# EAGLE design LPC1343 Module (EAGLE 6.3)
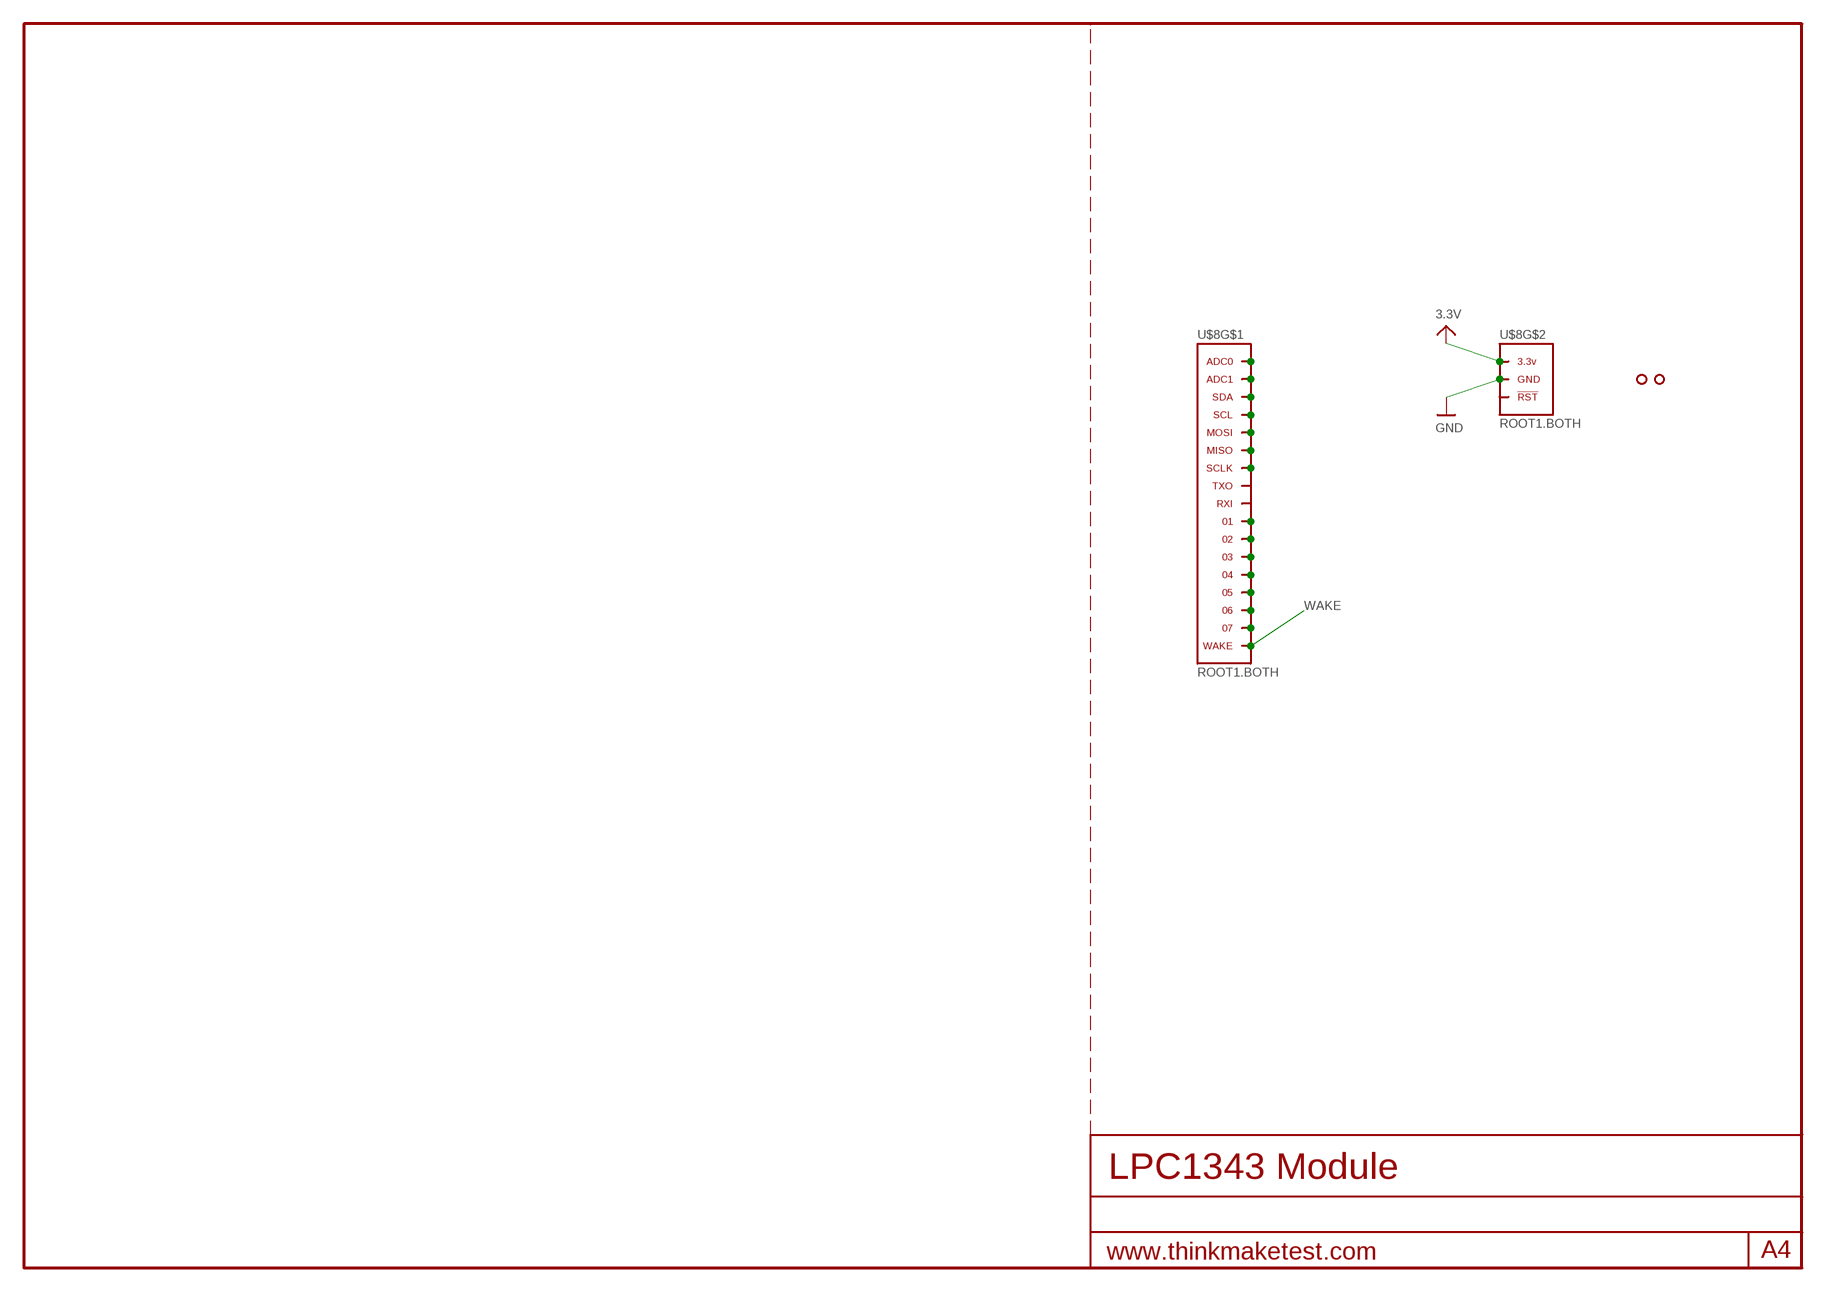
[diagram p0: schematic, sheet 1, part 1 of 2]
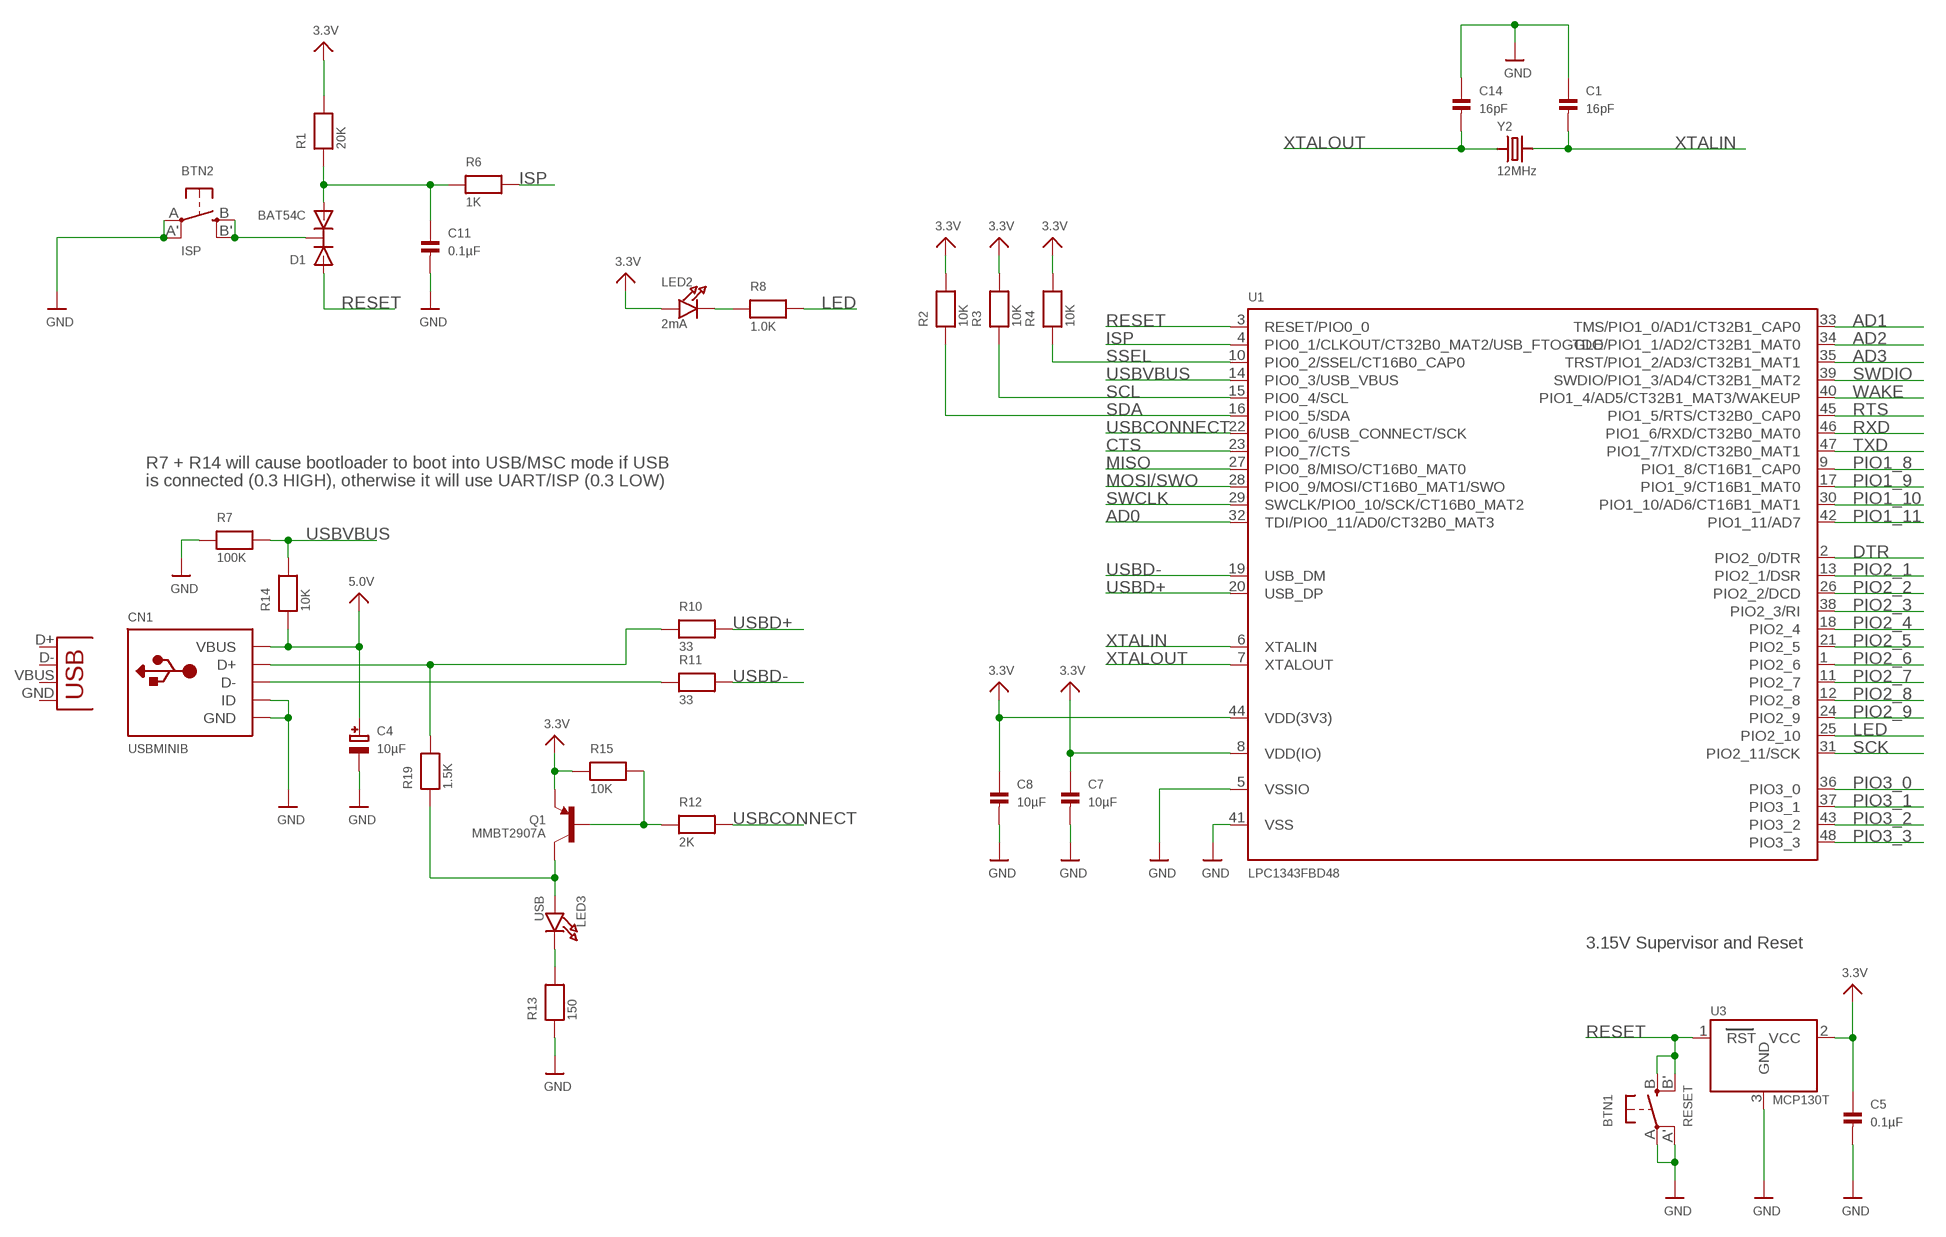
[diagram p1: schematic, sheet 1, part 2 of 2]

## Parts
BTN1  RESET  BUTTON_SMT  [EVQ-Q2]
BTN2  ISP  BUTTON_SMT  [EVQ-Q2]
C1  16pF  CAP_CERAMIC0603  [0603]
C4  10µF  CAP_TANTALUMA/3216_REFLOW  [EIA3216-18/A-R]
C5  0.1µF  CAP_CERAMIC0603  [0603]
C7  10µF  CAP_CERAMIC0805  [0805]
C8  10µF  CAP_CERAMIC0805  [0805]
C11  0.1µF  CAP_CERAMIC0603  [0603]
C14  16pF  CAP_CERAMIC0603  [0603]
CN1  USBMINIB  [USB-MINIB]
D1  BAT54C  [SOT23-R]
LED2  2mA  LED0805  [CHIPLED_0805]
LED3  USB  LED0805  [CHIPLED_0805]
Q1  MMBT2907A  TRANSISTOR_PNPSOT23-REFLOW  [SOT23-R]
R1  20K  RESISTOR0603  [0603]
R2  10K  RESISTOR0603  [0603]
R3  10K  RESISTOR0603  [0603]
R4  10K  RESISTOR0603  [0603]
R6  1K  RESISTOR0603  [0603]
R7  100K  RESISTOR0603  [0603]
R8  1.0K  RESISTOR0603  [0603]
R10  33  RESISTOR0603  [0603]
R11  33  RESISTOR0603  [0603]
R12  2K  RESISTOR0603  [0603]
R13  150  RESISTOR0603  [0603]
R14  10K  RESISTOR0603  [0603]
R15  10K  RESISTOR0603  [0603]
R19  1.5K  RESISTOR0603  [0603]
U1  LPC1343FBD48  LPC1343_QFP  [LQFP48]
U3  MCP130T  MCP130TREFLOW  [SOT23-R]
U$3  HOLE.2MM  [2MM]
U$4  HOLE.2MM  [2MM]
U$8  ROOT1.BOTH  [ROOT1.BOTH]
X1  USB-MICROB  [USB-MICROB]
Y2  12MHz  CRYSTALTHIN  [CRYSTAL_3.2X2.5]

## Nets
3.3V: C5.1 C7.1 C8.1 LED2.A Q1.2(E) R1.2 R2.2 R3.2 R4.2 R15.1 U1.8(VDD(IO)) U1.44(VDD(3V3)) U3.2(VCC) U$8.3.3V@1(3.3V) U$8.3.3V@2(3.3V) U$8.3.3V@3(3.3V) U$8.3.3V@4(3.3V) U$8.3.3V@5(3.3V) U$8.3.3V@6(3.3V) U$8.3.3V@7(3.3V) U$8.3.3V@8(3.3V) U$8.3.3V@9(3.3V) U$8.3.3V@10(3.3V) U$8.3.3V@11(3.3V) U$8.3.3V@12(3.3V) U$8.3.3V@13(3.3V) U$8.3.3V@14(3.3V) U$8.3.3V@15(3.3V) U$8.3.3V@16(3.3V) U$8.3.3V@17(3.3V) U$8.3.3V@18(3.3V) U$8.3.3V@19(3.3V) U$8.3.3V@20(3.3V) U$8.3.3V@21(3.3V) U$8.3.3V@22(3.3V) U$8.3.3V@23(3.3V) U$8.3.3V@24(3.3V) U$8.3.3V@VIA(3.3V)
5.0V: C4.+ CN1.VBUS R14.1
AD0: U1.32(TDI/PIO0_11/AD0/CT32B0_MAT3)
AD1: U1.33(TMS/PIO1_0/AD1/CT32B1_CAP0)
AD2: U1.34(TDO/PIO1_1/AD2/CT32B1_MAT0)
AD3: U1.35(TRST/PIO1_2/AD3/CT32B1_MAT1)
CTS: U1.23(PIO0_7/CTS)
DTR: U1.2(PIO2_0/DTR)
GND: BTN1.A'(P1) BTN1.A(P) BTN2.A'(P1) BTN2.A(P) C1.1 C4.- C5.2 C7.2 C8.2 C11.2 C14.1 CN1.GND CN1.ID R7.1 R13.1 U1.5(VSSIO) U1.41(VSS) U3.3(GND) U$8.GND@1(GND) U$8.GND@2(GND) U$8.GND@3(GND) U$8.GND@4(GND) U$8.GND@5(GND) U$8.GND@6(GND) U$8.GND@7(GND) U$8.GND@8(GND) U$8.GND@9(GND) U$8.GND@10(GND) U$8.GND@11(GND) U$8.GND@12(GND) U$8.GND@13(GND) U$8.GND@14(GND) U$8.GND@15(GND) U$8.GND@16(GND) U$8.GND@17(GND) U$8.GND@18(GND) U$8.GND@19(GND) U$8.GND@20(GND) U$8.GND@21(GND) U$8.GND@22(GND) U$8.GND@23(GND) U$8.GND@24(GND) U$8.GND@25(GND) U$8.GND@26(GND) U$8.GND@VIA(GND)
ISP: R6.2 U1.4(PIO0_1/CLKOUT/CT32B0_MAT2/USB_FTOGGLE)
LED: R8.2 U1.25(PIO2_10)
MISO: U1.27(PIO0_8/MISO/CT16B0_MAT0)
MOSI/SWO: U1.28(PIO0_9/MOSI/CT16B0_MAT1/SWO)
N$1: U$8.ADC0 U$8.ADC0@1(ADC0) U$8.ADC0@VIA(ADC0)
N$2: U$8.ADC1 U$8.ADC1@1(ADC1) U$8.ADC1@VIA(ADC1)
N$3: U$8.SDA U$8.SDA@1(SDA) U$8.SDA@VIA(SDA)
N$4: U$8.SCL U$8.SCL@1(SCL) U$8.SCL@VIA(SCL)
N$5: U$8.MOSI U$8.MOSI@1(MOSI) U$8.MOSI@VIA(MOSI)
N$6: U$8.MISO U$8.MISO@1(MISO) U$8.MISO@VIA(MISO)
N$7: U$8.SCLK U$8.SCLK@1(SCLK) U$8.SCLK@VIA(SCLK)
N$8: U$8.01 U$8.01@1 U$8.01@VIA
N$9: U$8.02 U$8.02@1 U$8.02@VIA
N$10: U$8.03 U$8.03@1 U$8.03@VIA
N$11: U$8.04 U$8.04@1 U$8.04@VIA
N$12: U$8.05 U$8.05@1 U$8.05@VIA
N$13: U$8.06 U$8.06@1 U$8.06@VIA
N$14: U$8.07 U$8.07@1 U$8.07@VIA
N$16: LED2.C R8.1
N$17: Q1.1(B) R12.1 R15.2
N$18: LED3.C R13.2
N$19: LED3.A Q1.3(C) R19.1
N$20: CN1.D- R11.1
N$21: CN1.D+ R10.1 R19.2
N$22: BTN2.B'(S1) BTN2.B(S) D1.3(C)
N$23: C11.1 D1.2(A2) R1.1 R6.1
PIO1_8: U1.9(PIO1_8/CT16B1_CAP0)
PIO1_9: U1.17(PIO1_9/CT16B1_MAT0)
PIO1_10: U1.30(PIO1_10/AD6/CT16B1_MAT1)
PIO1_11: U1.42(PIO1_11/AD7)
PIO2_1: U1.13(PIO2_1/DSR)
PIO2_2: U1.26(PIO2_2/DCD)
PIO2_3: U1.38(PIO2_3/RI)
PIO2_4: U1.18(PIO2_4)
PIO2_5: U1.21(PIO2_5)
PIO2_6: U1.1(PIO2_6)
PIO2_7: U1.11(PIO2_7)
PIO2_8: U1.12(PIO2_8)
PIO2_9: U1.24(PIO2_9)
PIO3_0: U1.36(PIO3_0)
PIO3_1: U1.37(PIO3_1)
PIO3_2: U1.43(PIO3_2)
PIO3_3: U1.48(PIO3_3)
RESET: BTN1.B'(S1) BTN1.B(S) D1.1(A1) U1.3(RESET/PIO0_0) U3.1(RST)
RTS: U1.45(PIO1_5/RTS/CT32B0_CAP0)
RXD: U1.46(PIO1_6/RXD/CT32B0_MAT0)
SCK: U1.31(PIO2_11/SCK)
SCL: R3.1 U1.15(PIO0_4/SCL)
SDA: R2.1 U1.16(PIO0_5/SDA)
SSEL: R4.1 U1.10(PIO0_2/SSEL/CT16B0_CAP0)
SWCLK: U1.29(SWCLK/PIO0_10/SCK/CT16B0_MAT2)
SWDIO: U1.39(SWDIO/PIO1_3/AD4/CT32B1_MAT2)
TXD: U1.47(PIO1_7/TXD/CT32B0_MAT1)
USBCONNECT: R12.2 U1.22(PIO0_6/USB_CONNECT/SCK)
USBD+: R10.2 U1.20(USB_DP)
USBD-: R11.2 U1.19(USB_DM)
USBVBUS: R7.2 R14.2 U1.14(PIO0_3/USB_VBUS)
WAKE: U1.40(PIO1_4/AD5/CT32B1_MAT3/WAKEUP) U$8.WAKE U$8.WAKE@1(WAKE) U$8.WAKE@VIA(WAKE)
XTALIN: C1.2 U1.6(XTALIN) Y2.2
XTALOUT: C14.2 U1.7(XTALOUT) Y2.1
Unconnected: U$8.RST(!RST) U$8.RST@1(!RST) U$8.RST@VIA(!RST) U$8.RXI U$8.RXI.DBG(RXI) U$8.RXI.DBG@1(RXI) U$8.RXI.DBG@VIA(RXI) U$8.RXI@1(RXI) U$8.RXI@VIA(RXI) U$8.TCK U$8.TCK@1(TCK) U$8.TCK@VIA(TCK) U$8.TDI U$8.TDI@1(TDI) U$8.TDI@VIA(TDI) U$8.TDO U$8.TDO@1(TDO) U$8.TDO@VIA(TDO) U$8.TMS U$8.TMS@1(TMS) U$8.TMS@VIA(TMS) U$8.TRST U$8.TRST@1(TRST) U$8.TRST@VIA(TRST) U$8.TXO U$8.TXO.DBG(TXO) U$8.TXO.DBG@1(TXO) U$8.TXO.DBG@VIA(TXO) U$8.TXO@1(TXO) U$8.TXO@VIA(TXO) X1.D+ X1.D- X1.GND X1.VBUS

## Notes on the sheet
- R7 + R14 will cause bootloader to boot into USB/MSC mode if USB
- is connected (0.3 HIGH), otherwise it will use UART/ISP (0.3 LOW)
- 3.15V Supervisor and Reset

## Library data of the parts
BTN1 BTN2 = microbuilder:BUTTON_SMT: SMT Push Button (6mm) Digikey: P12940SCT-ND
C1 C5 C7 C8 C11 C14 = microbuilder:CAP_CERAMIC: Ceramic Capacitors 0402 - 0402 Surface Mount Capacitors 16pF 50V 5% [Digikey: 445-4899-2-ND] 18pF 50V 5% [Digikey: 490-1281-2-ND] 22pF 50V 5% [Digikey: 490-1283-2-ND] 68pF 50V 5% [Digikey: 490-1289-2-ND] 0.1uF 10V 10% [Digikey: 490-1318-2-ND] 0603 - 0603 Surface Mount Capacitors 16 pF 50V 5% [Digikey: 445-5051-2-ND] 22 pF 50V [Digikey: PCC220ACVTR-ND] 33 pF 50V 5% [Digikey: 490-1415-1-ND] 56pF 50V 5% [Digikey: 490-1421-1-ND] 220pF 50V 5% [Digikey: 445-1285-1-ND] 680 pF 50V 2200 pF 50V 5% C0G [Digikey: 445-1297-1-ND] 5600 pF 100V 5% X7R [Digikey: 478-3711-1-ND] 0.1 µF 25V 10% [Digikey: PCC2277TR-ND] 0.22 µF 16V 10% X7R [Digikey: 445-1318-1-ND] 1.0 µF 25V 10% [Digikey: 445-5146-2-ND] 0603 - RF Specific 3pF 250V +/-0.1pF RF [Digikey: 712-1347-1-ND] 18 pF 250V 5% [Digikey: 478-3505-1-ND or 712-1322-1-ND] 56 pF 250V 5% C0G RF [Digikey: 490-4867-1-ND] 68 pF 250V RF [Digikey: 490-4868-1-ND] 0805 - 0805 Surface Mount Capacitors 220 pF 250V 2% RF Ceramic Capacitor [Digikey: 712-1398-1-ND] 1000 pF 50V 2% NP0 Ceramic Capacitor [Digikey: 478-3760-1-ND] 0.1 µF 25V 10% Ceramic Capacitor [Digikey: PCC1828TR-ND] 1.0 µF 16V 10% Ceramic Capacitor[Digikey: 490-1691-2-ND] 10.0 µF 10V 10% Ceramic Capacitor[Digikey: 709-1228-1-ND] 47 uF 6.3V 20% Ceramic Capacitor [Digikey: 399-5506-1-ND] 1206 - 1206 Surface Mount Capacitors 47uF 10V 20% Ceramic Capacitor [Digikey: 399-5508-1-ND]
C4 = microbuilder:CAP_TANTALUM: Tantalum Capacitors Wave footprints have larger pads and are meant to be used for hand soldering. Reflow footprints are optimised for solder paste and a reflow oven. EIA3216-18/A-[R/W] - Size A / 3216-18 / 1206 footprint 4.7µF 25V 10% Tantalum Capacitor 10µF 16V 10% Tantalum Capacitor [Digikey: 495-2236-2-ND] EIA3528-21/B-[R/W] - Size B / 3528-21 47µF 10V 10% Tantalum Capactior [Digikey: 495-2216-1-ND] EIA6032-28/C-[R/W] - Size C / 6032-28 10µF 35V 20% Tantalum Capacitor [Digikey: 495-2285-1-ND] 100µF 16V 10% Tantalum Capactior [Digikey: 399-5214-1-ND]
CN1 = microbuilder:USB: USB Connectors USBMINIB - Surface Mount Female Mini-B USB Connector 4UConnector: 06564
D1 = microbuilder:BAT54C: BAT54C Schottky Diodes (Common Cathode) 30V 200mA, SOT-23 Package Digikey: BAT54CFSCT-ND
LED2 LED3 = microbuilder:LED: LED 0603 - 0603 Surface Mount Package Green LED - Low Power (3.9mcd, 2ma, 1.7Vf) Orange LED - Low Power (9.8mcd, 2ma, 1.8Vf) Red LED - Low Power (5mcd, 2ma, 1.8Vf) Yellow LED - Low Power (7mcd, 2ma, 1.8Vf) 0805 - 0805 Surface Mount Package 20mA: Red LED (104mcd, 20mA, Diffused) - LS R976 [Digikey: 475-1278-6-ND] Red LED (12mcd, 20mA, 2.0Vf, Clear) - APT2012EC [Digikey: 754-1128-1-ND] Green LED (15mcd, 20mA, 2.2Vf, Clear) - APT2012GC [Digikey: 754-1131-1-ND] Orange LED (160mcd, 20mA, 2.1Vf, Clear) - APT2012SECK [Digikey: 754-1130-1-ND] 2mA: Red LED (8.8mcd, 2mA, 1.8Vf, Clear) - Low Power [Digikey: 475-2510-1-ND] Green LED (5mcd, 2mA, 1.8Vf, Clear) - Low Power [Digikey: 475-2730-1-ND] Yellow LED (11.3mcd, 2mA, 1.8Vf, Clear) - Low Power [Digikey: 475-2555-1-ND] 1206 - 1206 Surface Mount Package Green LED (26mcd, 20mA, Diffused) - LG N971 [Digikey: 475-1407-6-ND] Red LED (15mcd, 20mA, Diffused) - LH N974 [Digikey: 475-1416-6-ND]
Q1 = microbuilder:TRANSISTOR_PNP: PNP Transistor Transistor (PNP) 800mA 60V [Digikey: MMBT2907AFSTR-ND] SOT23-R - SOT23 footprint optimised for use with solder paste and reflow ovens. SOT23-W - SOT23 footprint optimised for hand-soldering (larger pads).
R1-R4 R6-R8 R10-R15 R19 = microbuilder:RESISTOR: Resistors 0402 - 0402 Surface Mount Package 22 Ohm 1% 1/16W [Digikey: 311-22.0LRTR-ND] 10.0K 1% 1/16W [Digikey: 311-10.0KLRTR-ND] 10.0K 5% 1/16W [Digikey: RMCF0402JT10K0TR-ND] 12.1K 1% 1/16W [Digikey: 311-22.0LRTR-ND] 0603 - 0603 Surface Mount Package 0 Ohm 1/10 Watt 1% Resistor 15 Ohm 1/10 Watt 1% Resistor 33 Ohm 1/10 Watt 1% Resistor 49.9 Ohm 1/10 Watt 1% Resistor 100 Ohm 1/10 Watt 1% Resistor 150 Ohm 1/10 Watt 1% Resistor 240 Ohm 1/10 Watt 1% Resistor 390 Ohm 1/10 Watt 1% Resistor 560 Ohm 1/10 Watt 1% Resistor 750 Ohm 1/10 Watt 1% Resistor 1.0K Ohm 1/10 Watt 1% Resistor 1.5K Ohm 1/10 Watt 1% Resistor 2.0K Ohm 1/10 Watt 1% Resistor 4.7K Ohm 1/10 Watt 1% Resistor 10.0K Ohm 1/10 Watt 1% Resistor 20.0K Ohm 1/10 Watt 1% Resistor 33.0K Ohm 1/10 Watt 1% Resistor 100.0K Ohm 1/10 Watt 1% Resistor 0805 - 0805 Surface Mount Package 0 Ohm 1/8 Watt 1% Resistor 33 Ohm 1/8 Watt 1% Resistor 100 Ohm 1/8 Watt 1% Resistor 150 Ohm 1/8 Watt 1% Resistor 200 Ohm 1/8 Watt 1% Resistor 240 Ohm 1/8 Watt 1% Resistor 330 Ohm 1/8 Watt 1% Resistor 390 Ohm 1/8 Watt 1% Resistor 470 Ohm 1/8 Watt 1% Resistor 1.0K Ohm 1/8 Watt 1% Resistor 1.5K Ohm 1/8 Watt 1% Resistor 2.0K Ohm 1/8 Watt 1% Resistor 4.7K Ohm 1/8 Watt 1% Resistor 5.1K Ohm 1/8 Watt 1% Resistor 5.6K Ohm 1/8 Watt 1% Resistor 10.0K Ohm 1/8 Watt 1% Resistor 22.0K Ohm 1/8 Watt 1% Resistor 33.0K Ohm 1/8 Watt 1% Resistor 100K Ohm 1/8 Watt 1% Resistor 1206 - 1206 Surface Mount Package
U1 = microbuilder:LPC1343_QFP: LPC1343 72 MHz 32-bit ARM Cortex-M3 microcontroller. 32 kB Flash, 8 kB SRAM, USB Device Mouser: 771-LPC1343FBD48151 Digikey: 568-4945-ND
U3 = microbuilder:MCP130T: MCP130T Voltage Supervisor (Active Low) Voltage supervisors will put the MCU in a reset state if the voltage drops below a pre-determined level. SOT23-R/SOT23-W: Voltage Supervisor - 3.15V Active Low Note: Use the "Reflow" footprint when working with solder paste, and the "Wave" footprint when soldering by hand with a soldering iron (the latter has larger pads that are easier to solder by hand). Digikey: MCP130T-315I/TTCT-ND
U$3 U$4 = .screw_holes:HOLE
U$8 = thinkmaketest:ROOT1
X1 = SparkFun:USB: USB Connectors USB-B-PTH is fully proven SKU : PRT-00139 USB-miniB is fully proven SKU : PRT-00587 USB-A-PCB is untested. USB-A-H is throughly reviewed, but untested. Spark Fun Electronics SKU : PRT-00437 USB-B-SMT is throughly reviewed, but untested. Needs silkscreen touching up. USB-A-S has not been used/tested USB-MB-H has not been used/tested
Y2 = microbuilder:CRYSTAL: Crystals HC49UP - Surface Mount Crystal 4.0MHz 18pF +/-30ppm Surface Mount Crystal [Digikey: 535-9857-1-ND] 12.0 MHz Surface Mount Crystal [Digikey: 535-9869-6-ND] 25.0 MHz Surface Mount Crystal [Digikey: 535-9078-1-ND] 3.2 x 2.5mm - MEMs SMT Crystal 12.0 MHz 8pF 15ppm 3.2 x 2.5mm Crystal [Digikey: 644-1047-1-ND] 16.0 MHz 8pF 15ppm 3.2 x 2.5mm Crystal [Digikey: 644-1049-1-ND] 16.0 MHz 10pF 10ppm 3.2 x 2.5mm Crystal [Digikey: 644-1100-1-ND] 27.12 MHz 18pF 30ppm 3.2 x 2.5mm Crystal [Digikey: 887-1424-1-ND] 4.9 x 1.8mm - MEMs SMT Crystal 32.768 KHz 12.5pF 20ppm 4.9 x 1.8mm Crystal [Digikey: SE2415CT-ND] Cylinder 32.768KHz Cylinder Crystal

## Board
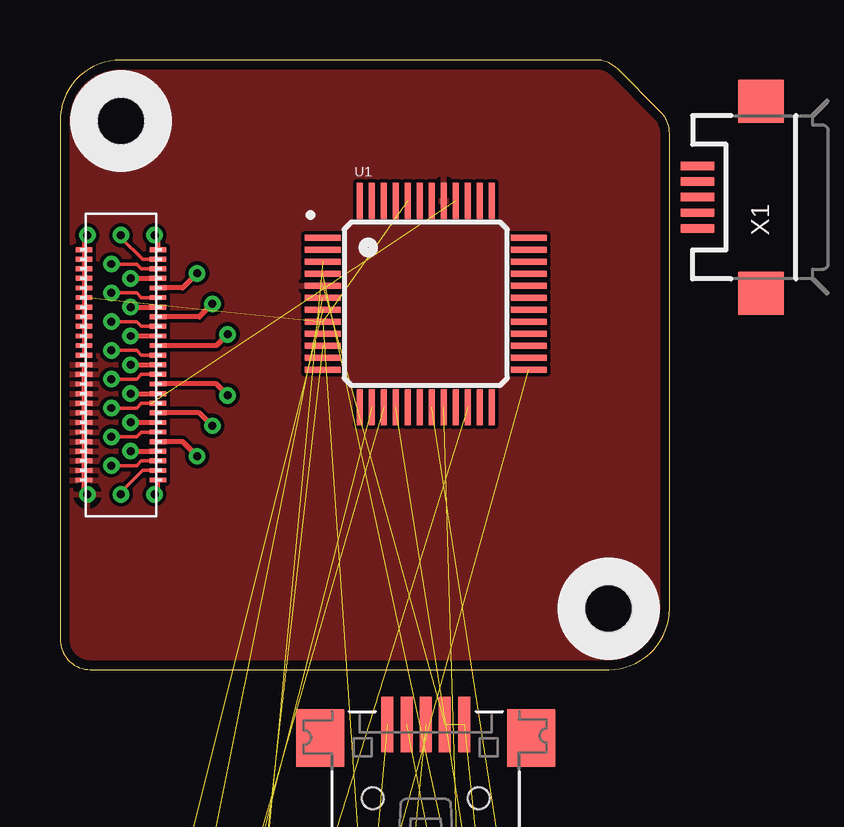
[diagram p2: board, top side]
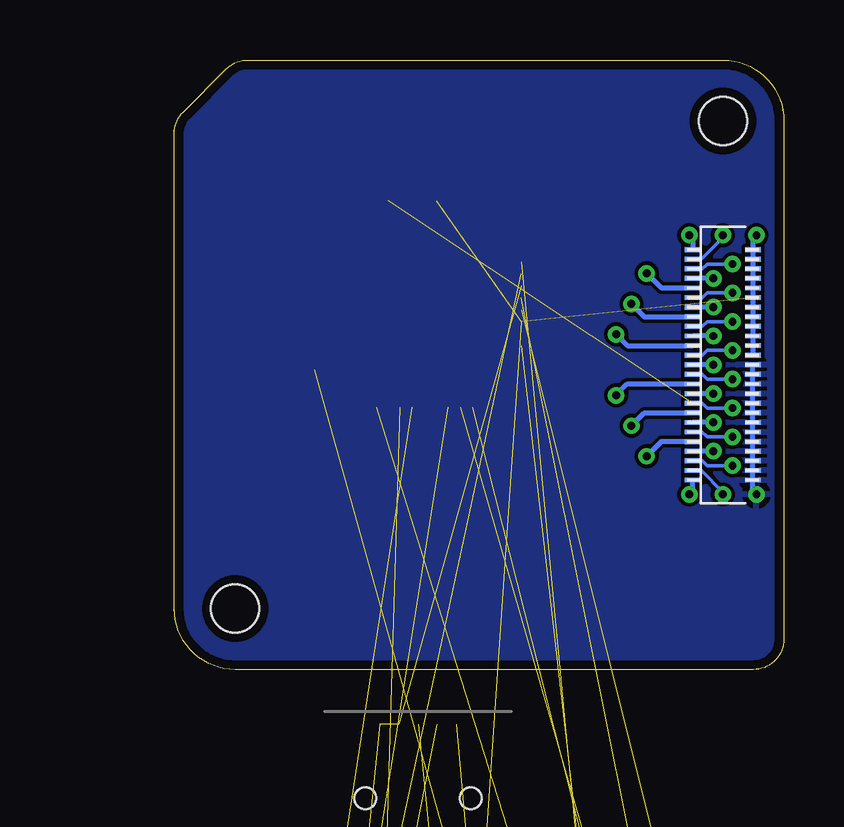
[diagram p3: board, bottom side, seen from below]

Size 25.4 x 25.4 mm. Coordinates in mm from the lower left corner, seen from the top.
Outline: 0,22.86 0,1.27 arc90 1.27,0 22.86,0 arc90 25.4,2.54 25.4,22.33 arc45 25.03,23.23 23.23,25.03 arc45 22.33,25.4 2.54,25.4 arc90 0,22.86
Copper layers (1*16): Top 0.0356mm / dielectric 1.5011mm / Bottom 0.0356mm
Design rules "default": minimum track width 6mil, minimum drill 13mil, track to track 6mil, track to pad 6mil, pad to pad 6mil, via to via 6mil, smd to smd 6mil, copper to edge 15mil, drill to drill 6mil, minimum pad ring 7mil, minimum via ring 7mil, stop-mask expansion 4mil, vias tented up to drill 16mil, thermal gap 10mil

### Footprints (pad centres in the part's own frame; a part is rotated, then mirrored left to right if it is on the bottom)
EVQ-Q2 = smd 3.2 x 1.2: A -3.4,-2; A' 3.4,-2; B -3.4,2; B' 3.4,2
0603 = smd 1.1 x 1: 1 -0.85,0; 2 0.85,0
EIA3216-18/A-R = smd 1.95 x 1.5: + 1.375,0; - -1.375,0
0805 = smd 1.3 x 1.5: 1 -0.95,0; 2 0.95,0
USB-MINIB = smd 0.5 x 2.308: D+ 0,4.064; D- -0.8,4.064; GND 1.6,4.064; ID 0.8,4.064; VBUS -1.6,4.064 | smd 2 x 2.4: GND1 -4.4,-2; GND2 -4.4,3.5; GND3 4.4,3.5; GND4 4.4,-2 | hole 0.9: -2.2,1; 2.2,1
SOT23-R = smd 0.6 x 0.7: 1 -0.95,-1; 2 0.95,-1; 3 0,1
CHIPLED_0805 = smd 1.2 x 1.2: A 0,-1.05; C 0,1.05
LQFP48 = smd 1.5 x 0.25: 1 -4.3,2.75; 2 -4.3,2.25; 3 -4.3,1.75; 4 -4.3,1.25; 5 -4.3,0.75; 6 -4.3,0.25; 7 -4.3,-0.25; 8 -4.3,-0.75; 9 -4.3,-1.25; 10 -4.3,-1.75; 11 -4.3,-2.25; 12 -4.3,-2.75; 25 4.3,-2.75; 26 4.3,-2.25; 27 4.3,-1.75; 28 4.3,-1.25; 29 4.3,-0.75; 30 4.3,-0.25; 31 4.3,0.25; 32 4.3,0.75; 33 4.3,1.25; 34 4.3,1.75; 35 4.3,2.25; 36 4.3,2.75 | smd 0.25 x 1.5: 13 -2.75,-4.3; 14 -2.25,-4.3; 15 -1.75,-4.3; 16 -1.25,-4.3; 17 -0.75,-4.3; 18 -0.25,-4.3; 19 0.25,-4.3; 20 0.75,-4.3; 21 1.25,-4.3; 22 1.75,-4.3; 23 2.25,-4.3; 24 2.75,-4.3; 37 2.75,4.3; 38 2.25,4.3; 39 1.75,4.3; 40 1.25,4.3; 41 0.75,4.3; 42 0.25,4.3; 43 -0.25,4.3; 44 -0.75,4.3; 45 -1.25,4.3; 46 -1.75,4.3; 47 -2.25,4.3; 48 -2.75,4.3
2MM = hole 2: 0,0
ROOT1.BOTH = smd 0.66 x 0.2 bottom: 01 3.795,13.9; 02 3.795,13.5; 03 3.795,13.1; 3.3V@1 1.285,17.5; 3.3V@2 1.285,17.1; 3.3V@3 1.285,16.7; 3.3V@4 1.285,16.3; 3.3V@5 1.285,15.9; 3.3V@6 1.285,15.5; 3.3V@7 1.285,15.1; 3.3V@8 1.285,14.7; 3.3V@9 1.285,14.3; 3.3V@10 1.285,13.9; 3.3V@11 1.285,13.5; 3.3V@12 1.285,13.1; 04 3.795,12.7; 05 3.795,12.3; 06 3.795,11.9; 07 3.795,11.5; ADC0 3.795,17.5; ADC1 3.795,17.1; GND@1 1.285,7.9; GND@2 1.285,8.3; GND@3 1.285,8.7; GND@4 1.285,9.1; GND@5 1.285,9.5; GND@6 1.285,9.9; GND@7 1.285,10.3; GND@8 1.285,10.7; GND@9 1.285,11.1; GND@10 1.285,11.5; GND@11 1.285,11.9; GND@12 1.285,12.3; GND@13 1.285,12.7; MISO 3.795,15.5; MOSI 3.795,15.9; RST 3.795,7.9; RXI 3.795,14.3; RXI.DBG 3.795,10.3; SCL 3.795,16.3; SCLK 3.795,15.1; SDA 3.795,16.7; TCK 3.795,9.1; TDI 3.795,9.9; TDO 3.795,9.5; TMS 3.795,8.7; TRST 3.795,8.3; TXO 3.795,14.7; TXO.DBG 3.795,10.7; WAKE 3.795,11.1 | smd 0.7 x 0.2: 01@1 4.08,13.9; 02@1 4.08,13.5; 3.3V@13 1,17.5; 3.3V@14 1,17.1; 3.3V@15 1,16.7; 3.3V@16 1,16.3; 3.3V@17 1,15.9; 3.3V@18 1,15.5; 3.3V@19 1,15.1; 3.3V@20 1,14.7; 3.3V@21 1,14.3; 3.3V@22 1,13.9; 3.3V@23 1,13.5; 3.3V@24 1,13.1; 03@1 4.08,13.1; 04@1 4.08,12.7; 05@1 4.08,12.3; 06@1 4.08,11.9; 07@1 4.08,11.5; ADC0@1 4.08,17.5; ADC1@1 4.08,17.1; GND@14 1,7.9; GND@15 1,8.3; GND@16 1,8.7; GND@17 1,9.1; GND@18 1,9.5; GND@19 1,9.9; GND@20 1,10.3; GND@21 1,10.7; GND@22 1,11.1; GND@23 1,11.5; GND@24 1,11.9; GND@25 1,12.3; GND@26 1,12.7; MISO@1 4.08,15.5; MOSI@1 4.08,15.9; RST@1 4.08,7.9; RXI.DBG@1 4.08,10.3; RXI@1 4.08,14.3; SCL@1 4.08,16.3; SCLK@1 4.08,15.1; SDA@1 4.08,16.7; TCK@1 4.08,9.1; TDI@1 4.08,9.9; TDO@1 4.08,9.5; TMS@1 4.08,8.7; TRST@1 4.08,8.3; TXO.DBG@1 4.08,10.7; TXO@1 4.08,14.7; WAKE@1 4.08,11.1 | drill 0.33 pad 0.686: 01@VIA 2.94,13.9; 02@VIA 6.985,13.97; 3.3V@VIA 1.14,18.1; 03@VIA 2.14,13.3; 04@VIA 2.94,12.7; 05@VIA 2.14,12.1; 06@VIA 6.985,11.43; 07@VIA 2.94,11.5; ADC0@VIA 3.94,18.1; ADC1@VIA 2.54,18.1; GND@VIA 1.14,7.3; MISO@VIA 2.14,15.7; MOSI@VIA 5.715,16.51; RST@VIA 3.94,7.3; RXI.DBG@VIA 2.94,10.3; RXI@VIA 2.14,14.5; SCL@VIA 2.94,16.3; SCLK@VIA 2.94,15.1; SDA@VIA 2.14,16.9; TCK@VIA 2.94,9.1; TDI@VIA 2.14,9.7; TDO@VIA 5.715,8.89; TMS@VIA 2.14,8.5; TRST@VIA 2.54,7.3; TXO.DBG@VIA 6.35,10.16; TXO@VIA 6.35,15.24; WAKE@VIA 2.14,10.9
USB-MICROB = smd 0.35 x 1.4: D+ 0,2.65; D- -0.65,2.65; GND 1.3,2.65; ID 0.65,2.65; VBUS -1.3,2.65 | smd 1.8 x 1.9: MT1 -4,0; MT2 4,0
CRYSTAL_3.2X2.5 = smd 1.4 x 1.2: 1 -1.1,-0.8; 2 1.1,0.8; GND1 -1.1,0.8; GND2 1.1,-0.8

### Placement (x,y rotation side)
BTN1  4.45,-17.78 0 top  (outside the outline)
BTN2  15.24,-17.78 0 top  (outside the outline)
C1  18.41,-28.57 0 top  (outside the outline)
C4  1.91,-39.37 0 top  (outside the outline)
C5  6.99,-28.57 0 top  (outside the outline)
C7  8.89,-39.37 0 top  (outside the outline)
C8  15.24,-39.37 0 top  (outside the outline)
C11  12.7,-28.57 0 top  (outside the outline)
C14  23.5,-28.57 0 top  (outside the outline)
CN1  15.24,-6.35 0 top
D1  0.64,-29.21 0 top  (outside the outline)
LED2  5.71,-24.13 0 top  (outside the outline)
LED3  8.89,-24.13 0 top  (outside the outline)
Q1  12.7,-24.13 0 top  (outside the outline)
R1  16.51,-31.75 0 top  (outside the outline)
R2  21.59,-31.75 0 top  (outside the outline)
R3  1.27,-34.29 0 top  (outside the outline)
R4  6.35,-34.29 0 top  (outside the outline)
R6  21.59,-36.83 0 top  (outside the outline)
R7  1.27,-31.75 0 top  (outside the outline)
R8  6.35,-31.75 0 top  (outside the outline)
R10  16.51,-34.29 0 top  (outside the outline)
R11  21.59,-34.29 0 top  (outside the outline)
R12  1.27,-36.83 0 top  (outside the outline)
R13  6.35,-36.83 0 top  (outside the outline)
R14  11.43,-36.83 0 top  (outside the outline)
R15  16.51,-36.83 0 top  (outside the outline)
R19  11.43,-31.75 0 top  (outside the outline)
U1  15.24,15.24 0 top
U3  19.68,-24.13 0 top  (outside the outline)
U$3  22.86,2.54 90 top
U$4  2.54,22.86 90 top
U$8  0,0 0 top
X1  29.21,19.68 90 top
Y2  1.91,-24.77 0 top  (outside the outline)

### Tracks (layer width: path | path; a pad name or v marks a point on that pad's centre or on a via)
3.3V  (13 unrouted)
5.0V  (2 unrouted)
GND  (16 unrouted)
  pour Bottom: 0,0 25.4,0 25.4,25.4 0,25.4
  pour Top: 0,0 25.4,0 25.4,25.4 0,25.4
ISP  (1 unrouted)
LED  (1 unrouted)
N$16  (1 unrouted)
N$17  (2 unrouted)
N$18  (1 unrouted)
N$19  (2 unrouted)
N$20  (1 unrouted)
N$21  (2 unrouted)
N$22  (2 unrouted)
N$23  (3 unrouted)
RESET  (4 unrouted)
SCL  (1 unrouted)
SDA  (1 unrouted)
SSEL  (1 unrouted)
USBCONNECT  (1 unrouted)
USBD+  (1 unrouted)
USBD-  (1 unrouted)
USBVBUS  (2 unrouted)
WAKE  (1 unrouted)
XTALIN  (2 unrouted)
XTALOUT  (2 unrouted)